# Altium schematic sheet 4.SchDoc
size A4
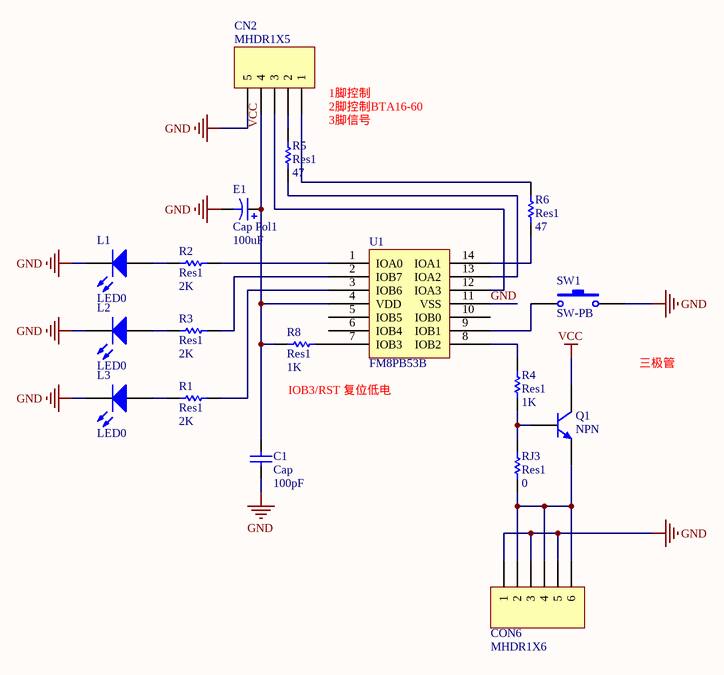
[diagram p0: 4.SchDoc]

## Parts
C1  Cap  value 100pF  [C0805]
CN2  MHDR1X5  [HDR1X5]
CON6  MHDR1X6  [HDR1X6]
E1  Cap Pol1  value 100uF  [CAP]
L1  LED0  [LED_DIP]
L2  LED0  [LED_DIP]
L3  LED0  [LED_DIP]
Q1  NPN  [SOT23_N]
R1  Res1  value 2K  [6-0805_N]
R2  Res1  value 2K  [6-0805_N]
R3  Res1  value 2K  [6-0805_N]
R4  Res1  value 1K  [6-0805_N]
R5  Res1  value 47  [6-0805_N]
R6  Res1  value 47  [6-0805_N]
R8  Res1  value 1K  [6-0805_N]
RJ3  Res1  value 0  [6-0805_N]
SW1  SW-PB  [SW_DIP]
U1  FM8PB53B  [SOP14]

## Nets
GND: C1.2 CN2.5 CON6.1 CON6.3 CON6.5 E1.2 L1.2(K) L2.2(K) L3.2(K) SW1.2 U1.11(VSS)
VCC: C1.1 CN2.4 E1.1 Q1.1(C) R8.1 U1.4(VDD)
NetCN2_1: CN2.1 R6.1
NetCN2_2: CN2.2 R5.2
NetCN2_3: CN2.3 U1.12(IOA3)
NetCON6_2: CON6.2 CON6.4 CON6.6 Q1.3(E) RJ3.1
NetL1_1: L1.1(A) R2.1
NetL2_1: L2.1(A) R3.1
NetL3_1: L3.1(A) R1.1
NetQ1_2: Q1.2(B) R4.1 RJ3.2
NetR1_2: R1.2 U1.3(IOB6)
NetR2_2: R2.2 U1.1(IOA0)
NetR3_2: R3.2 U1.2(IOB7)
NetR4_2: R4.2 U1.8(IOB2)
NetR5_1: R5.1 U1.13(IOA2)
NetR6_2: R6.2 U1.14(IOA1)
NetR8_2: R8.2 U1.7(IOB3)
NetSW1_1: SW1.1 U1.9(IOB1)

Not connected (* = marked no-connect by the designer): U1 5(IOB5) 6(IOB4) 10(IOB0)

## Notes on the sheet
- (near CN2) 1脚控制
- 2脚控制BTA16-60
- 3脚信号
- IOB3/RST 复位低电
- 三极管

## Library data of the parts
C1 = Cap: Capacitor; Published: 8-Jun-2000; LatestRevisionDate: 17-Jul-2002; LatestRevisionNote: Re-released for DXP Platform.; PackageReference: RAD-0.3; Publisher: Altium Limited; PackageDescription: Radial Cap, Thru-Hole; 2 Leads; 0.3 in Pin Spacing
CN2 = MHDR1X5: Header, 5-Pin; LatestRevisionDate: 17-Jul-2002; LatestRevisionNote: Re-released for DXP Platform.; Publisher: Altium Limited
CON6 = MHDR1X6: Header, 6-Pin; LatestRevisionDate: 17-Jul-2002; LatestRevisionNote: Re-released for DXP Platform.; Publisher: Altium Limited
E1 = Cap Pol1: Polarized Capacitor (Radial); Published: 8-Jun-2000; LatestRevisionDate: 17-Jul-2002; LatestRevisionNote: Re-released for DXP Platform.; PackageReference: RB7.6-15; Publisher: Altium Limited; PackageDescription: Polarized Capacitor (Radial); 2 Leads
L1-L3 = LED0: Typical INFRARED GaAs LED; Published: 8-Jun-2000; LatestRevisionDate: 08-Jul-2005; LatestRevisionNote: Mech Layer 1 removed.; PackageReference: LED-0; Publisher: Altium Limited; PackageDescription: LED; 2 Leads
Q1 = NPN: NPN Bipolar Transistor; Published: 8-Jun-2000; LatestRevisionDate: 17-Jul-2002; LatestRevisionNote: Re-released for DXP Platform.; PackageReference: TO-226-AA; Publisher: Altium Limited; PackageDescription: TO, Flat Index; 3 In-Line, Axial Leads; Body Dia. 4.8mm; Leads 0.55 x 0.51 mm (max); Code_JEDEC: TO-226-AA
R1-R6 R8 RJ3 = Res1: Resistor; Published: 8-Jun-2000; LatestRevisionDate: 17-Jul-2002; LatestRevisionNote: Re-released for DXP Platform.; PackageReference: AXIAL-0.3; Publisher: Altium Limited; PackageDescription: Axial Device, Thru-Hole; 2 Leads; 0.3 in Pin Spacing
SW1 = SW-PB: Switch; Published: 24-Mar-1999; LatestRevisionDate: 17-Jul-2002; LatestRevisionNote: Re-released for DXP Platform.; PackageReference: SPST-2; Publisher: Altium Limited; PackageDescription: Switch; 2 Leads